# Altium schematic sheet HEART RATE.SchDoc
size A
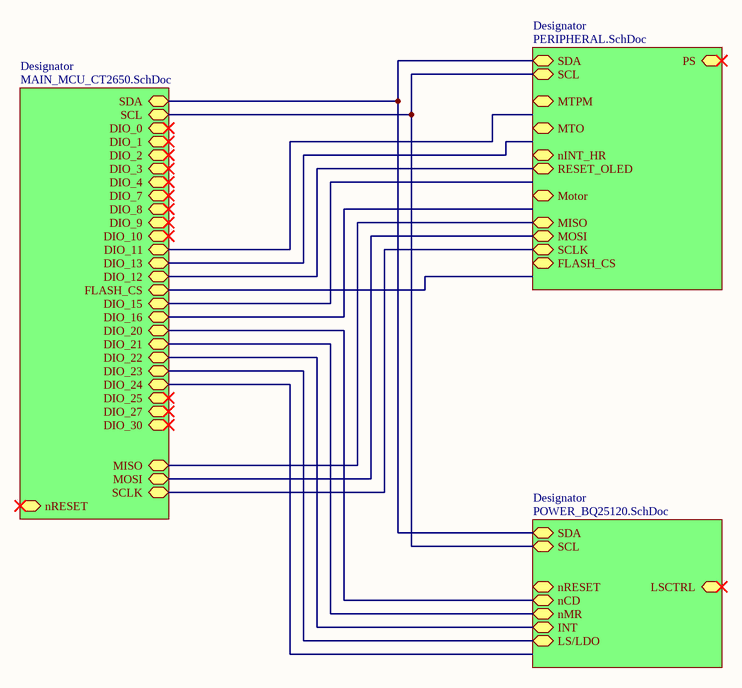
[diagram p0: HEART RATE.SchDoc]

## Sub-sheets
Designator = POWER_BQ25120.SchDoc: SDA, SCL, nRESET, nMR, nCD, LSCTRL, LS/LDO, INT
Designator = MAIN_MCU_CT2650.SchDoc: DIO_0, DIO_1, DIO_2, DIO_3, DIO_4, DIO_7, DIO_10, DIO_11, DIO_12, DIO_13, DIO_15, DIO_16, DIO_20, DIO_21, DIO_22, DIO_23, DIO_24, DIO_25, DIO_27, DIO_30, MISO, MOSI, SCLK, SCL, SDA, FLASH_CS, DIO_8, DIO_9, nRESET
Designator = PERIPHERAL.SchDoc: SDA, SCL, RESET_OLED, nINT_HR, MTPM, MTO, Motor, MOSI, MISO, SCLK, FLASH_CS, PS

## Nets
(unnamed): sheet Designator/SDA, sheet Designator/SDA, sheet Designator/SDA
(unnamed): sheet Designator/SCL, sheet Designator/SCL, sheet Designator/SCL
(unnamed): sheet Designator/nMR, sheet Designator/DIO_21
(unnamed): sheet Designator/nCD, sheet Designator/DIO_20
(unnamed): sheet Designator/LS/LDO, sheet Designator/DIO_23
(unnamed): sheet Designator/INT, sheet Designator/DIO_22
(unnamed): sheet Designator/DIO_12, sheet Designator/RESET_OLED
(unnamed): sheet Designator/MISO, sheet Designator/MISO
(unnamed): sheet Designator/MOSI, sheet Designator/MOSI
(unnamed): sheet Designator/SCLK, sheet Designator/SCLK